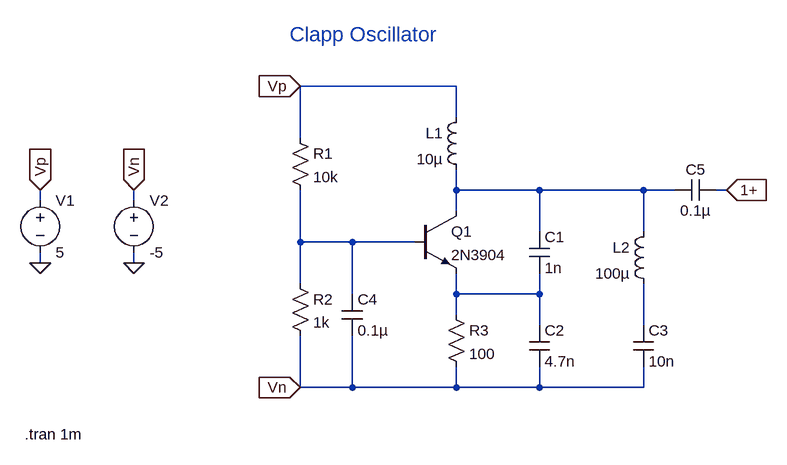
[diagram p0: schematic clapp_osc_ltspice.asc]
clapp_osc_ltspice.asc, the LTspice schematic file:
Version 4
SHEET 1 1084 784
WIRE 384 192 144 192
WIRE 384 240 384 192
WIRE 144 272 144 192
WIRE 384 352 384 320
WIRE 512 352 384 352
WIRE 672 352 512 352
WIRE 720 352 672 352
WIRE 800 352 784 352
WIRE -256 368 -256 352
WIRE -112 368 -112 352
WIRE 384 384 384 352
WIRE 512 416 512 352
WIRE 672 416 672 352
WIRE 144 432 144 352
WIRE 224 432 144 432
WIRE 320 432 224 432
WIRE -256 464 -256 448
WIRE -112 464 -112 448
WIRE 144 496 144 432
WIRE 224 512 224 432
WIRE 384 512 384 480
WIRE 512 512 512 480
WIRE 512 512 384 512
WIRE 384 544 384 512
WIRE 512 560 512 512
WIRE 672 560 672 496
WIRE 144 656 144 576
WIRE 224 656 224 576
WIRE 224 656 144 656
WIRE 384 656 384 624
WIRE 384 656 224 656
WIRE 512 656 512 624
WIRE 512 656 384 656
WIRE 672 656 672 624
WIRE 672 656 512 656
FLAG 800 352 1+
IOPIN 800 352 In
FLAG 144 192 Vp
IOPIN 144 192 In
FLAG 144 656 Vn
IOPIN 144 656 In
FLAG -256 464 0
FLAG -112 464 0
FLAG -256 352 Vp
IOPIN -256 352 In
FLAG -112 352 Vn
IOPIN -112 352 In
SYMBOL res 128 256 R0
SYMATTR InstName R1
SYMATTR Value 10k
SYMBOL res 128 480 R0
SYMATTR InstName R2
SYMATTR Value 1k
SYMBOL npn 320 384 R0
SYMATTR InstName Q1
SYMATTR Value 2N3904
SYMBOL res 368 528 R0
SYMATTR InstName R3
SYMATTR Value 100
SYMBOL cap 208 512 R0
SYMATTR InstName C4
SYMATTR Value 0.1µ
SYMBOL cap 784 336 R90
WINDOW 0 0 32 VBottom 2
WINDOW 3 32 32 VTop 2
SYMATTR InstName C5
SYMATTR Value 0.1µ
SYMBOL voltage -256 352 R0
WINDOW 123 0 0 Left 0
WINDOW 39 0 0 Left 0
SYMATTR InstName V1
SYMATTR Value 5
SYMBOL voltage -112 352 R0
WINDOW 123 0 0 Left 0
WINDOW 39 0 0 Left 0
SYMATTR InstName V2
SYMATTR Value -5
SYMBOL ind 400 224 M0
SYMATTR InstName L1
SYMATTR Value 10µ
SYMBOL cap 496 416 R0
SYMATTR InstName C1
SYMATTR Value 1n
SYMBOL cap 496 560 R0
SYMATTR InstName C2
SYMATTR Value 4.7n
SYMBOL cap 656 560 R0
SYMATTR InstName C3
SYMATTR Value 10n
SYMBOL ind 688 400 M0
SYMATTR InstName L2
SYMATTR Value 100µ
TEXT 128 112 Left 3 ;Clapp Oscillator
TEXT -280 728 Left 2 !.tran 1m

The netlist it stands for:
* clapp_osc_ltspice.asc
R1 Vp N002 10k
R2 N002 Vn 1k
Q1 N001 N002 N003 0 2N3904
R3 N003 Vn 100
C4 N002 Vn 0.1µ
C5 1+ N001 0.1µ
V1 Vp 0 5
V2 Vn 0 -5
L1 Vp N001 10µ
C1 N001 N003 1n
C2 N003 Vn 4.7n
C3 N004 Vn 10n
L2 N001 N004 100µ
.model NPN NPN
.model PNP PNP
.lib standard.bjt
* Clapp Oscillator
.tran 1m
.backanno
.end